# Altium schematic sheet 33.SchDoc
size 513 x 386 mm
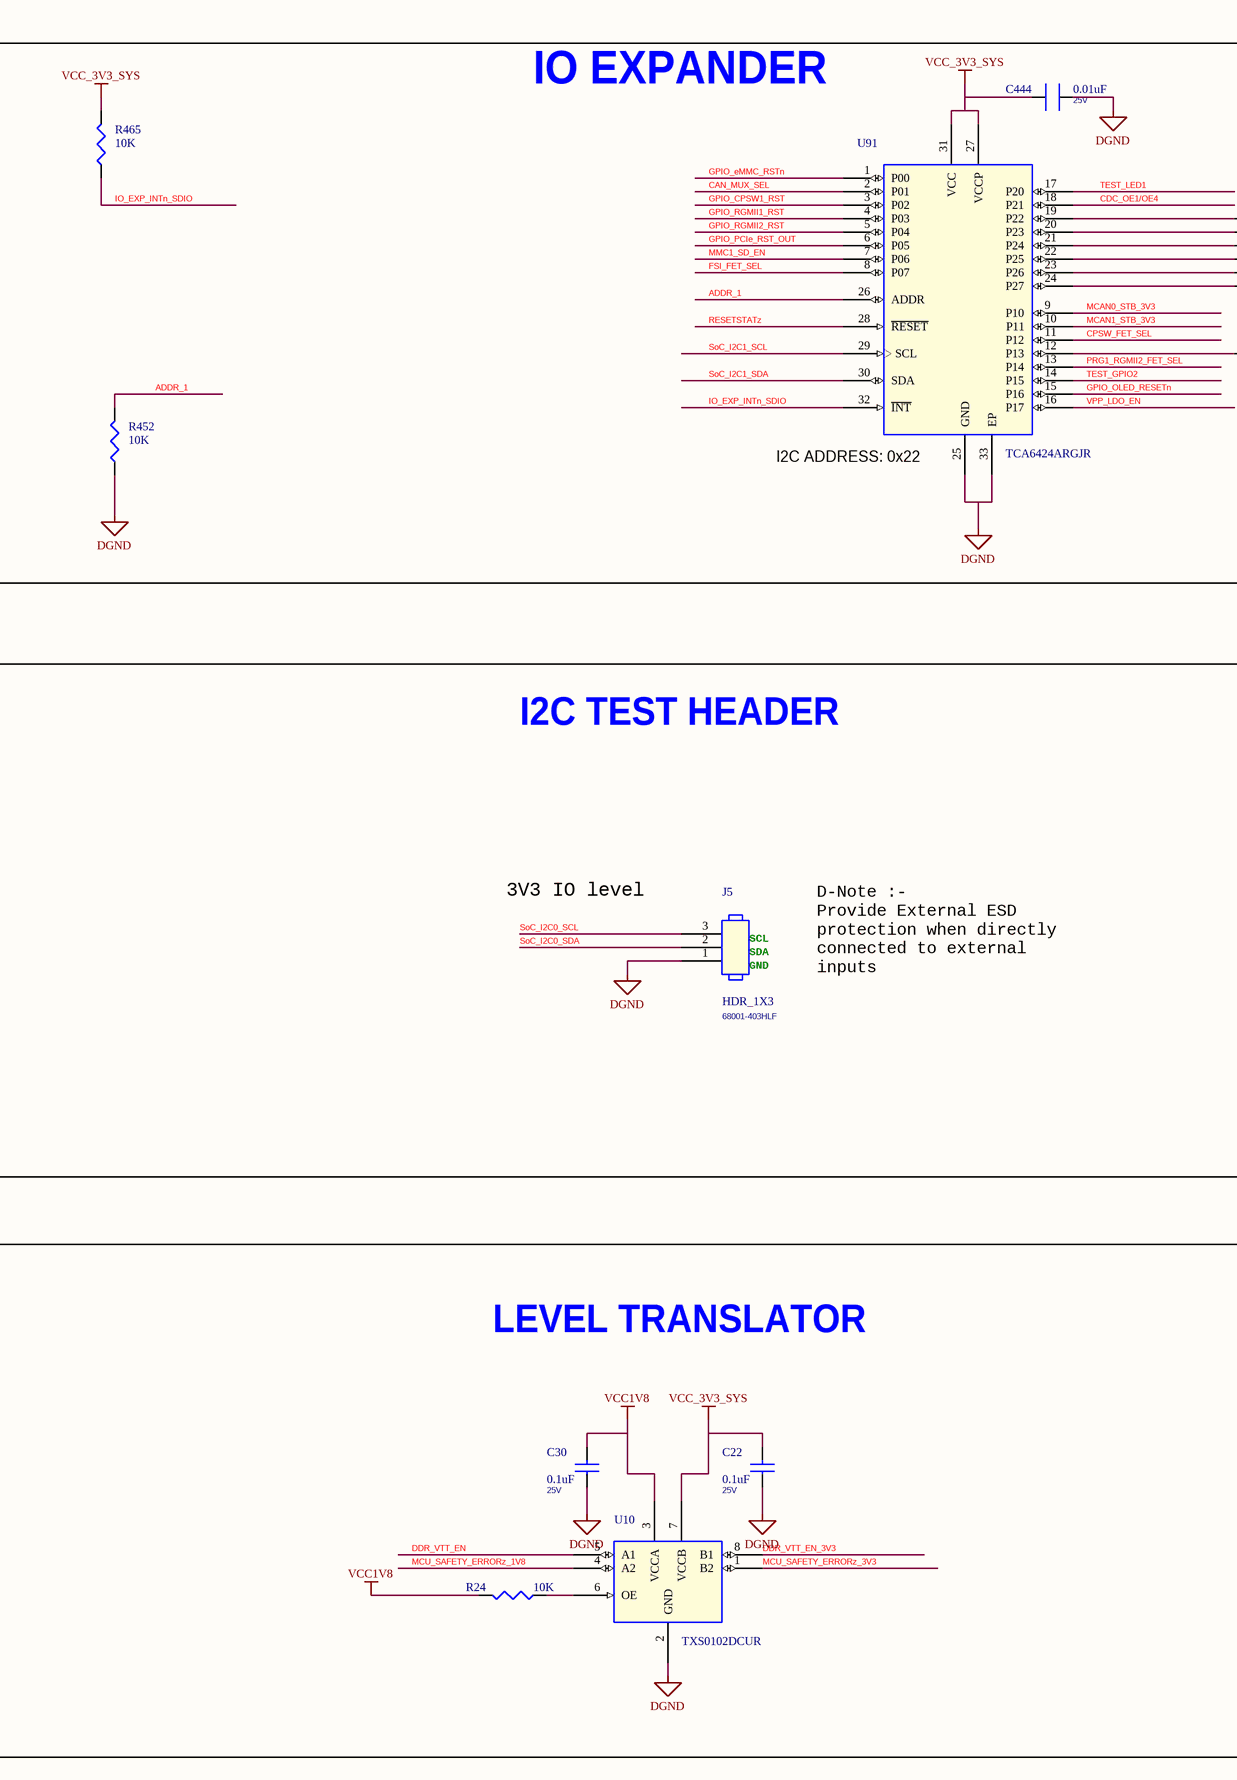
[diagram p0: 33.SchDoc, left]
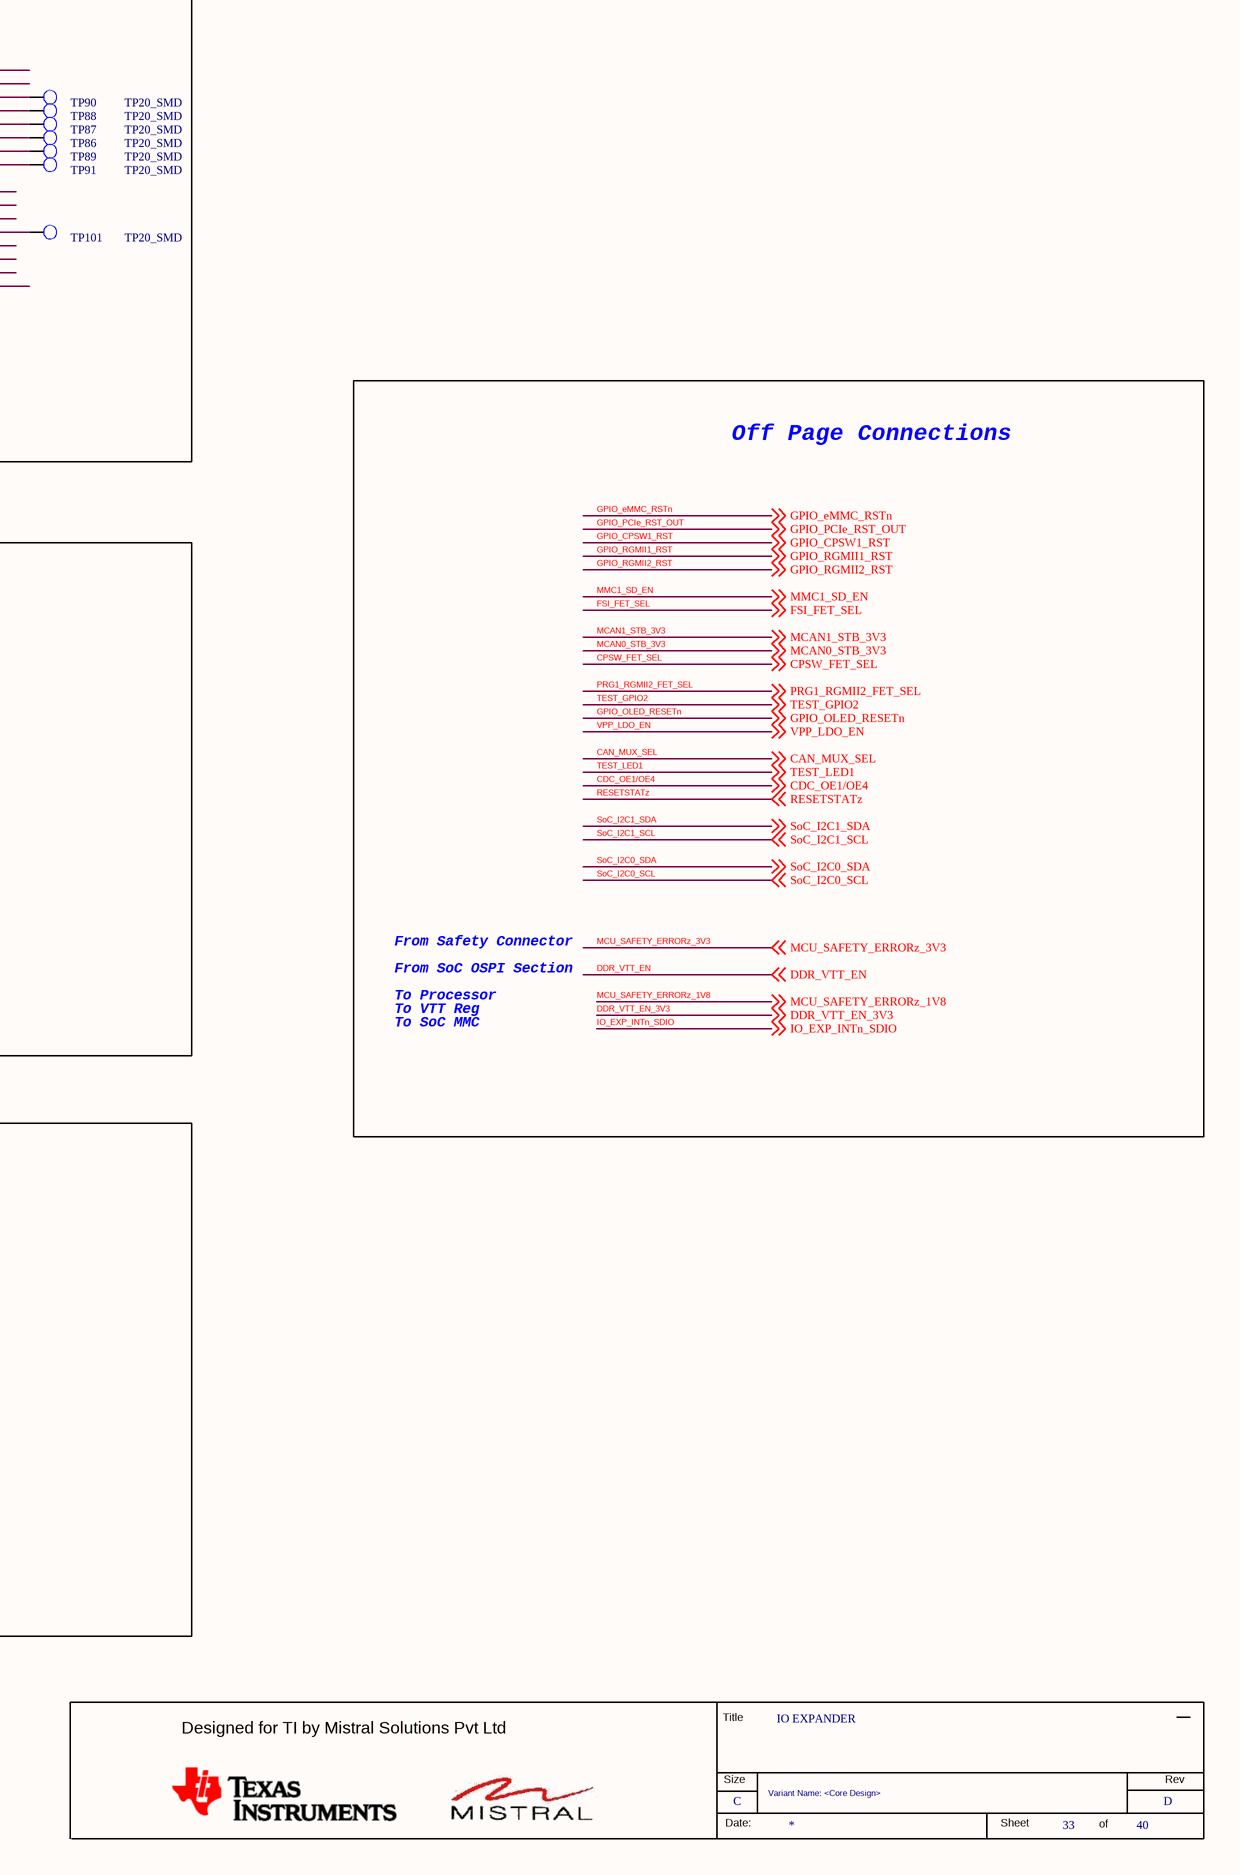
[diagram p1: 33.SchDoc, right]

## Parts
*  RevCode: D  Title: IO EXPANDER  Page Size: C  Page Number: 33  Page Count: 40  Variant Name: <Core Design>  (hidden comment: MISTRAL_TITLEBLK_CSIZE)  (graphical)
C22  0.1uF  Voltage: 25V  [CAP0402_0-75]
C30  0.1uF  Voltage: 25V  [CAP0402_0-75]
C444  0.01uF  Voltage: 25V  [CAP0402N]
J5  HDR_1X3  Mfr_part_number: 68001-403HLF  [HDR_3X1_100_S_T]
R24  10K  [RES0402_0-5]
R452  10K  [RES0402_0-5]
R465  10K  [RES0402_0-5]
TP86  TP20_SMD  [TP20_SMD]
TP87  TP20_SMD  [TP20_SMD]
TP88  TP20_SMD  [TP20_SMD]
TP89  TP20_SMD  [TP20_SMD]
TP90  TP20_SMD  [TP20_SMD]
TP91  TP20_SMD  [TP20_SMD]
TP101  TP20_SMD  [TP20_SMD]
U10  TXS0102DCUR  [VSSOP8_19-68_85X95_0-9]
U91  TCA6424ARGJR  [QFN32_19-68_200X200]

## Blocks framed on the sheet
IO EXPANDER: C444 R452 R465 TP86-TP91 TP101 U91
I2C TEST HEADER: J5
LEVEL TRANSLATOR: C22 C30 R24 U10

## Nets
DGND: C22.1 C30.1 C444.1 J5.1 R452.1 U10.2(GND) U91.25(GND) U91.33(EP)
VCC1V8: C30.2 R24.2 U10.3(VCCA)
VCC_3V3_SYS: C22.2 C444.2 R465.2 U10.7(VCCB) U91.27(VCCP) U91.31(VCC)
ADDR_1: R452.2 U91.26(ADDR)
CAN_MUX_SEL: U91.2(P01) ; off-sheet CAN_MUX_SEL
CDC_OE1/OE4: U91.18(P21) ; off-sheet CDC_OE1/OE4
CPSW_FET_SEL: U91.11(P12) ; off-sheet CPSW_FET_SEL
DDR_VTT_EN: U10.5(A1) ; off-sheet DDR_VTT_EN
DDR_VTT_EN_3V3: U10.8(B1) ; off-sheet DDR_VTT_EN_3V3
FSI_FET_SEL: U91.8(P07) ; off-sheet FSI_FET_SEL
GPIO_CPSW1_RST: U91.3(P02) ; off-sheet GPIO_CPSW1_RST
GPIO_eMMC_RSTn: U91.1(P00) ; off-sheet GPIO_eMMC_RSTn
GPIO_OLED_RESETn: U91.15(P16) ; off-sheet GPIO_OLED_RESETn
GPIO_PCIe_RST_OUT: U91.6(P05) ; off-sheet GPIO_PCIe_RST_OUT
GPIO_RGMII1_RST: U91.4(P03) ; off-sheet GPIO_RGMII1_RST
GPIO_RGMII2_RST: U91.5(P04) ; off-sheet GPIO_RGMII2_RST
IO_EXP_INTn_SDIO: R465.1 U91.32(~{INT}) ; off-sheet IO_EXP_INTn_SDIO
MCAN0_STB_3V3: U91.9(P10) ; off-sheet MCAN0_STB_3V3
MCAN1_STB_3V3: U91.10(P11) ; off-sheet MCAN1_STB_3V3
MCU_SAFETY_ERRORz_1V8: U10.4(A2) ; off-sheet MCU_SAFETY_ERRORz_1V8
MCU_SAFETY_ERRORz_3V3: U10.1(B2) ; off-sheet MCU_SAFETY_ERRORz_3V3
MMC1_SD_EN: U91.7(P06) ; off-sheet MMC1_SD_EN
PRG1_RGMII2_FET_SEL: U91.13(P14) ; off-sheet PRG1_RGMII2_FET_SEL
RESETSTATz: U91.28(~{RESET}) ; off-sheet RESETSTATz
SoC_I2C0_SCL: J5.3 ; off-sheet SoC_I2C0_SCL
SoC_I2C0_SDA: J5.2 ; off-sheet SoC_I2C0_SDA
SoC_I2C1_SCL: U91.29(SCL) ; off-sheet SoC_I2C1_SCL
SoC_I2C1_SDA: U91.30(SDA) ; off-sheet SoC_I2C1_SDA
TEST_GPIO2: U91.14(P15) ; off-sheet TEST_GPIO2
TEST_LED1: U91.17(P20) ; off-sheet TEST_LED1
VPP_LDO_EN: U91.16(P17) ; off-sheet VPP_LDO_EN
NetR24_1: R24.1 U10.6(OE)
NetTP86_1: TP86.1(TP) U91.22(P25)
NetTP87_1: TP87.1(TP) U91.21(P24)
NetTP88_1: TP88.1(TP) U91.20(P23)
NetTP89_1: TP89.1(TP) U91.23(P26)
NetTP90_1: TP90.1(TP) U91.19(P22)
NetTP91_1: TP91.1(TP) U91.24(P27)
NetTP101_1: TP101.1(TP) U91.12(P13)

## Notes on the sheet
- (near U91) I2C ADDRESS: 0x22
- Off Page Connections
- 3V3 IO level
- D-Note :-
  Provide External ESD
  protection when directly
  connected to external
  inputs
- (near J5) SCL
- (near J5) SDA
- (near J5) GND
- To Processor
- From Safety Connector
- From SoC OSPI Section
- To VTT Reg
- To SoC MMC
- (in symbol MISTRAL_TITLEBLK_CSIZE) Title; Designed for TI by Mistral Solutions Pvt Ltd; Size; Rev; Date:; Sheet; of

## Library data of the parts
* = MISTRAL_TITLEBLK_CSIZE: Issue: 1.0; Page Create Date: March  8, 1995; Page Modify Date: *
C22 C30 = CAP_Dup3: CAP CERAMIC 0.1uF 25V 20% X5R 0402; Alt_Mfr_name: YAGEO AMERICA; Part_type: CAPACITORS\CERAMIC; Mfr_part_number: 885012105018; Mfr_name: WURTH ELECTRONICS; Mistral Part No: 120020080003-R; Alt_Mfr_part_number: CC0402KRX5R8BB104; Custom_Duty: 15%; Customs_HS_Code: 85322990; Wattage: NA; Project: AM64x_EVM_BRD; PCB Footprint: CAP0402_0-75; Footprint Path: Y:\MIS_DATABASE\Library\ALTIUM_TOOL\PCB_FOOTPRINTS\Altium_Footprint_Lib.PcbLib; Library Path: Y:\MIS_DATABASE\Library\ALTIUM_TOOL\SCHEMATICS_PARTS\MS_DISCRETE_Library.schlib; Footprint Ref: CAP0402_0-75; Library Ref: CAP; MECHANICAL 3D STEP FILE: CAP0402_0-75; Chkd/date: MANIRAJA/170820; Crtd /date: ALVY/170820; Datasheet: Y:\MIS_DATABASE\DATASHEETS\CAPACITORS\885012105018.PDF; Temperature: -55癈+85癈; Weight: 0.65mg; Height: 0.55MM; Distributor_part_number: 732-7495-1-ND; Distributor_name: DIGIKEY; Package: 0402; Tolerance: 20%
C444 = CAP_Dup2: CAP CERAMIC 0.01uF 25V 10% X7R 0402; Part_type: CAPACITORS\CERAMIC; Mfr_part_number: 885012205050; Mfr_name: WURTH ELECTRONICS; Mistral Part No: 120011090040-R; PCB Footprint: CAP0402_0-75; Wattage: NA; Custom_Duty: 15%; Customs_HS_Code: 85322990; Project: AM64x_EVM_BRD; Footprint Path: Y:\MIS_DATABASE\Library\ALTIUM_TOOL\PCB_FOOTPRINTS\Altium_Footprint_Lib.PcbLib; Library Path: Y:\MIS_DATABASE\Library\ALTIUM_TOOL\SCHEMATICS_PARTS\MS_DISCRETE_Library.schlib; Footprint Ref: CAP0402_0-75; MECHANICAL 3D STEP FILE: CAP0402_0-75; Temperature: -55癈+125癈; Weight: 0.65mg; Chkd/date: MANIRAJA/170820; Crtd /date: ALVY/170820; Datasheet: Y:\MIS_DATABASE\DATASHEETS\CAPACITORS\885012205050.PDF; Height: 0.55MM; Distributor_part_number: 732-7545-1-ND; Distributor_name: DIGIKEY; Package: 0402; Tolerance: 10%; Library Ref: CAP
J5 = HEADER_3X1: HDR 1X3 2.54MM PITCH ST TH; Mistral Part No: 150016060025-R; Mfr_name: FCI; Part_type: CONNECTOR\HEADERS; Project: IKEYP; Tolerance: NA; Customs_HS_Code: 85322990; Custom_Duty: 15%; Voltage: NA; Wattage: NA; Package: THRU-HOLE; Distributor_name: DIGIKEY; Distributor_part_number: 609-3471-ND; Height: 8.58MM; Weight: NA; Temperature: -40癈+105癈; Datasheet: Y:\MIS_DATABASE\DATASHEETS\CONNECTORS\68000.PDF; Crtd /date: VASANTHA/290616; Chkd/date: VASANTHA/290616; Library Ref: HEADER_3X1; PCB Footprint: HDR_3X1_100_S_T
R24 R452 = RESISTOR_Dup6: RES 10K 1/16W 5% 0402; Part_type: RESISTORS\FIXED; Mfr_part_number: RC0402JR-0710KL; Mfr_name: YAGEO AMERICA; Mistral Part No: 110011060021-R; Custom_Duty: 15%; Customs_HS_Code: 85332119; Voltage: NA; Project: HSE; Footprint Path: Y:\MIS_DATABASE\Library\ALTIUM_TOOL\PCB_FOOTPRINTS\Altium_Footprint_Lib.PcbLib; Library Path: Y:\MIS_DATABASE\Library\ALTIUM_TOOL\SCHEMATICS_PARTS\MS_DISCRETE_Library.schlib; Footprint Ref: RES0402_0-5; Library Ref: RESISTOR; MECHANICAL 3D STEP FILE: RES0402_0-5; Chkd/date: VASANTHA/061216; Crtd /date: MAZHAR/230805; Datasheet: Y:\MIS_DATABASE\DATASHEETS\RESISTORS\RCXXXXL-SER_MAR18.PDF; Temperature: -55癈+155癈; Weight: 0.65mg; Height: 0.40MM; Distributor_part_number: 311-10KJRCT-ND; Distributor_name: DIGIKEY; Package: 0402; Wattage: 1/16W; Tolerance: 5%; PCB Footprint: RES0402_0-5
R465 = RESISTOR_Dup6: RES 10K 1/16W 5% 0402; Mistral Part No: 110011060021-R; Mfr_name: YAGEO AMERICA; Mfr_part_number: RC0402JR-0710KL; Part_type: RESISTORS\FIXED; Project: HSE; Voltage: NA; Customs_HS_Code: 85332119; Custom_Duty: 15%; PCB Footprint: RES0402_0-5; Footprint Path: Y:\MIS_DATABASE\Library\ALTIUM_TOOL\PCB_FOOTPRINTS\Altium_Footprint_Lib.PcbLib; Library Path: Y:\MIS_DATABASE\Library\ALTIUM_TOOL\SCHEMATICS_PARTS\MS_DISCRETE_Library.schlib; Footprint Ref: RES0402_0-5; Library Ref: RESISTOR; Tolerance: 5%; Wattage: 1/16W; Package: 0402; Distributor_name: DIGIKEY; Distributor_part_number: 311-10KJRCT-ND; Height: 0.40MM; Weight: 0.65mg; Temperature: -55癈+155癈; Datasheet: Y:\MIS_DATABASE\DATASHEETS\RESISTORS\RCXXXXL-SER_MAR18.PDF; Crtd /date: MAZHAR/230805; Chkd/date: VASANTHA/061216; MECHANICAL 3D STEP FILE: RES0402_0-5
TP86-TP91 = TESTPOINT: TESTPOINT CIR 20 SMD; Mfr_name: LOCAL; Custom_Duty: NA; Project: BT MODULE_CSRBC04; Customs_HS_Code: NA; PCB Footprint: TP20_SMD; RoHS: NA; Footprint Ref: TP20_SMD; Library Ref: TESTPOINT; Footprint Path: Y:\MIS_DATABASE\Library\ALTIUM_TOOL\PCB_FOOTPRINTS\Altium_Footprint_Lib.PcbLib; Library Path: Y:\MIS_DATABASE\Library\ALTIUM_TOOL\SCHEMATICS_PARTS\MS_DISCRETE_Library.schlib; MECHANICAL 3D STEP FILE: NA; Datasheet: NA; Temperature: NA; Weight: NA; Wattage: NA; Voltage: NA; Tolerance: NA; Chkd/date: SHREESHAIL/171006; Crtd /date: MAZHAR/171006; Height: NA; Distributor_part_number: NA; Distributor_name: NA; Package: SMD; Part_type: TESTPOINT; Mfr_part_number: TP20_SMD; Mistral Part No: NA
TP101 = TESTPOINT: TESTPOINT CIR 20 SMD; Mistral Part No: NA; Mfr_name: LOCAL; Project: BT MODULE_CSRBC04; Mfr_part_number: TP20_SMD; Part_type: TESTPOINT; Package: SMD; Distributor_name: NA; Distributor_part_number: NA; Height: NA; Crtd /date: MAZHAR/171006; Chkd/date: SHREESHAIL/171006; Tolerance: NA; Voltage: NA; Wattage: NA; Weight: NA; Temperature: NA; Datasheet: NA; MECHANICAL 3D STEP FILE: NA; Library Path: Y:\MIS_DATABASE\Library\ALTIUM_TOOL\SCHEMATICS_PARTS\MS_DISCRETE_Library.schlib; Footprint Path: Y:\MIS_DATABASE\Library\ALTIUM_TOOL\PCB_FOOTPRINTS\Altium_Footprint_Lib.PcbLib; Library Ref: TESTPOINT; Footprint Ref: TP20_SMD; RoHS: NA; Customs_HS_Code: NA; Custom_Duty: NA; PCB Footprint: TP20_SMD
U10 = TXS0102DCUR_VSSOP8: IC 2BIT BI-DIR VOLTAGE-LEVEL TRANSLATOR US8(VSSOP8); Mistral Part No: 141009030376-R; Mfr_name: TEXAS INSTRUMENTS; Part_type: ICS\INTERFACE\LEVEL TRANSLATOR; Project: SD_WATERLOO; Tolerance: NA; Customs_HS_Code: 85423100; Custom_Duty: 15%; PCB Footprint: VSSOP8_19-68_85X95_0-9; Footprint Ref: VSSOP8_19-68_85X95_0-9; Library Ref: TXS0102DCUR_VSSOP8; Mfr_part_number: TXS0102DCUR; Voltage: NA; Wattage: NA; Package: US8; Distributor_name: DIGIKEY; Distributor_part_number: 296-21931-1-ND; Height: 0.90MM; Weight: 9.6mg; Temperature: -40癈+85癈; Datasheet: Y:\MIS_DATABASE\DATASHEETS\ICS\INTERFACE\TXS0102.PDF; Crtd /date: SHREESHAIL/190108; Chkd/date: MANIRAJA/130617; MECHANICAL 3D STEP FILE: VSSOP8_19-68_85X95_0-9; Library Path: Y:\MIS_DATABASE\Library\ALTIUM_TOOL\SCHEMATICS_PARTS\MS_MISCINTERFACE_Library.schlib; Footprint Path: Y:\MIS_DATABASE\Library\ALTIUM_TOOL\PCB_FOOTPRINTS\Altium_Footprint_Lib.PcbLib
U91 = TCA6424ARGJR_QFN32: IC I2C I/O EXPANDER 24B UQFN32; Part_type: ICS\DIGITAL\BUSTRANSCEIVER; Mfr_name: TEXAS INSTRUMENTS; Mistral Part No: 141014090009-R; Custom_Duty: 15%; Customs_HS_Code: 85423100; Project: ZK_BIOMETRIC; PCB Footprint: QFN32_19-68_200X200; Library Ref: TCA6424ARGJR_QFN32; Chkd/date: NAVEED/100715; Crtd /date: NAVEED/100914; Datasheet: Y:\MIS_DATABASE\DATASHEETS\ICS\DIGITAL\BUSTRANSCEIVER\TCA6424AR.PDF; Temperature: -40癈+85癈; Weight: NA; Height: 0.60MM; Distributor_part_number: 296-27844-1-ND; Distributor_name: DIGIKEY; Package: UQFN32; Mfr_part_number: TCA6424ARGJR